# Altium schematic sheet transmitter rev2.SchDoc
size A; SheetNumber: 1; SheetTotal: 1
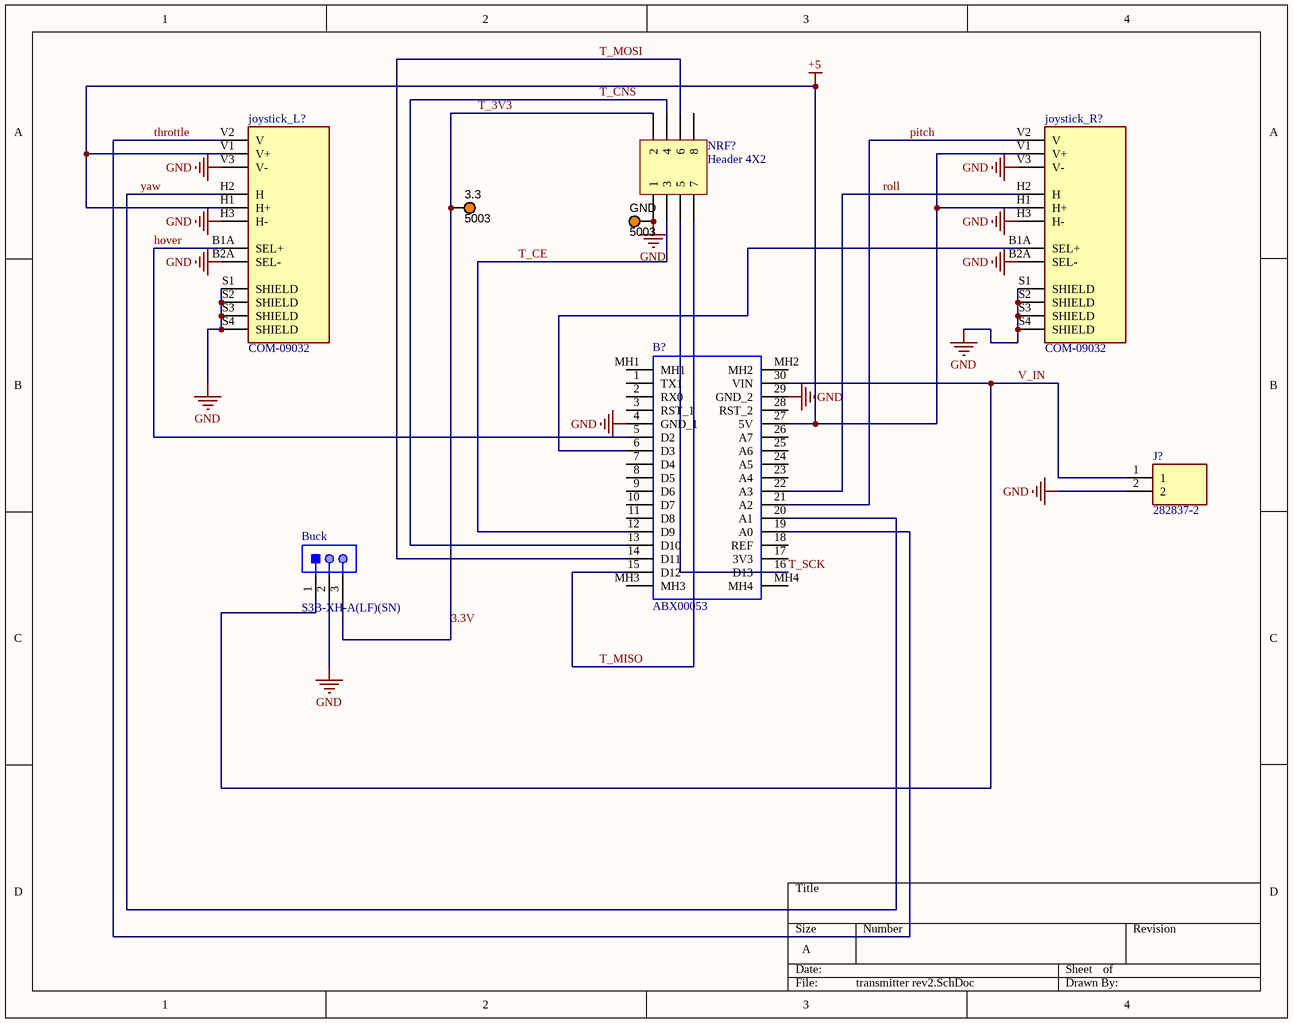
[diagram p0: transmitter rev2.SchDoc]

## Parts
3.3  5003  [KSTN-5003]
B?  ABX00053  [ABX00053]
Buck  S3B-XH-A(LF)(SN)  [JST-S3B-XH-A(LF)(SN)_V]
GND  5003  [KSTN-5003]
J?  282837-2  [2828372]
joystick_L?  COM-09032  [XDCR_COM-09032]
joystick_R?  COM-09032  [XDCR_COM-09032]
NRF?  Header 4X2  [HDR2X4]

## Nets
+5: B?.27(5V) joystick_L?.H1(H+) joystick_L?.V1(V+) joystick_R?.H1(H+) joystick_R?.V1(V+)
GND: B?.4(GND_1) B?.29(GND_2) Buck.2 GND.1 J?.2 joystick_L?.B2A(SEL-) joystick_L?.H3(H-) joystick_L?.S1(SHIELD) joystick_L?.S2(SHIELD) joystick_L?.S3(SHIELD) joystick_L?.S4(SHIELD) joystick_L?.V3(V-) joystick_R?.B2A(SEL-) joystick_R?.H3(H-) joystick_R?.S1(SHIELD) joystick_R?.S2(SHIELD) joystick_R?.S3(SHIELD) joystick_R?.S4(SHIELD) joystick_R?.V3(V-) NRF?.1
3.3V: 3.3.1 Buck.3 NRF?.2  [also labelled T_3V3]
hover: B?.5(D2) joystick_L?.B1A(SEL+)
pitch: B?.21(A2) joystick_R?.V2(V)
roll: B?.22(A3) joystick_R?.H2(H)
T_CE: B?.12(D9) NRF?.3
T_CNS: B?.13(D10) NRF?.4
T_MISO: B?.15(D12) NRF?.7
T_MOSI: B?.14(D11) NRF?.6
T_SCK: B?.16(D13) NRF?.5
throttle: B?.19(A0) joystick_L?.V2(V)
V_IN: B?.30(VIN) Buck.1 J?.1
yaw: B?.20(A1) joystick_L?.H2(H)
NetB?_6: B?.6(D3) joystick_R?.B1A(SEL+)

Not connected (* = marked no-connect by the designer): B? 1(TX1) 2(RX0) 3(RST_1) 7(D4) 8(D5) 9(D6) 10(D7) 11(D8) 17(3V3) 18(REF) 23(A4) 24(A5) 25(A6) 26(A7) 28(RST_2) MH1 MH2 MH3 MH4; NRF? 8

## Library data of the parts
3.3 GND = CMP-002-00037-2: Test Point, Orange, Height 4.6 mm, Tail Length 3 mm, 1-Pin THD, RoHS; Manufacturer: Keystone; Colour: Orange; Packaging: Bulk; Package Description: 1-Pin Through Hole Device, Dia 2.54 mm; Pins: 1; Package Reference: 5003; Datasheet Version: Jun-15; Case/Package: 5003; Mounting Technology: TH; Connector Type: TestPoint; Diameter: 2.54mm; Contact Material: Bronze; Datasheet URL: http://keyelco.com/userAssets/file/M65p56.pdf; Manufacturer URL: http://www.keyelco.com/; Package Quantity: 10; Contact Plating: Tin; RoHS Compliant: True
B? = ABX00053: Development Boards & Kits - AVR Arduino Nano RP2040 Connect with header; Geometry.Height: 3.25mm; Manufacturer_Name: Arduino; Manufacturer_Part_Number: ABX00053; Mouser Part Number: 782-ABX00053; Mouser Price/Stock: https://www.mouser.co.uk/ProductDetail/Arduino/ABX00053?qs=iLbezkQI%252Bsj092HEuR%252Bsvg%3D%3D; Arrow Part Number: ABX00053; Arrow Price/Stock: https://www.arrow.com/en/products/abx00053/arduino-corporation?region=nac; Mouser Testing Part Number: *; Mouser Testing Price/Stock: *; Datasheet Link: https://content.arduino.cc/assets/ABX00053-datasheet.pdf
Buck = CMP-002-00033-2: Male Header, Pitch 2.5 mm, 1 x 3 Position, Height 6.1 mm, Tail Length 3.4 mm, -25 to 85 degC, RoHS, Bulk; Manufacturer: JST; Package Description: Male Header, Pitch 2.5 mm, 1 x 3 Position, Height 6.1 mm, Tail Length 3.4 mm; Manufacturer URL: http://www.jst.com/home2.html; Datasheet URL: http://www.jst-mfg.com/product/pdf/eng/eXH.pdf; RoHS Compliant: Unknown; Connector Type: Header; Package Reference: S3B-XH-A(LF)(SN); Gender: Male; Case/Package: S3B-XH-A(LF)(SN); Mounting Technology: TH; Max Operating Temperature: 85°C; Min Operating Temperature: -25°C; Datasheet Version: May-16
J? = 282837-2: Fixed Terminal Blocks 5.08MM PCB MOUNT 2P; Manufacturer_Name: TE Connectivity; Geometry.Height: 10.3mm; Manufacturer_Part_Number: 282837-2; Mouser Part Number: 571-2828372; Mouser Price/Stock: https://www.mouser.co.uk/ProductDetail/TE-Connectivity/282837-2?qs=A%252Bip%252BNCYi6O2H0NGWOeAxg%3D%3D; Arrow Part Number: 282837-2; Arrow Price/Stock: https://www.arrow.com/en/products/282837-2/te-connectivity?region=europe; Datasheet Link: https://www.te.com/commerce/DocumentDelivery/DDEController?Action=srchrtrv&DocNm=282837&DocType=Customer+Drawing&DocLang=English&DocFormat=pdf&PartCntxt=282837-2
joystick_L? joystick_R? = COM-09032: Thumb Joystick; Price: None; Availability: Unavailable; MP: COM-09032; Value: *; Package: None
NRF? = Header 4X2: Header, 4-Pin, Dual row; LatestRevisionDate: 17-Jul-2002; LatestRevisionNote: Re-released for DXP Platform.; Publisher: Altium Limited